# Altium schematic sheet Sheet_1 copy.schdoc
size 309 x 204 mm
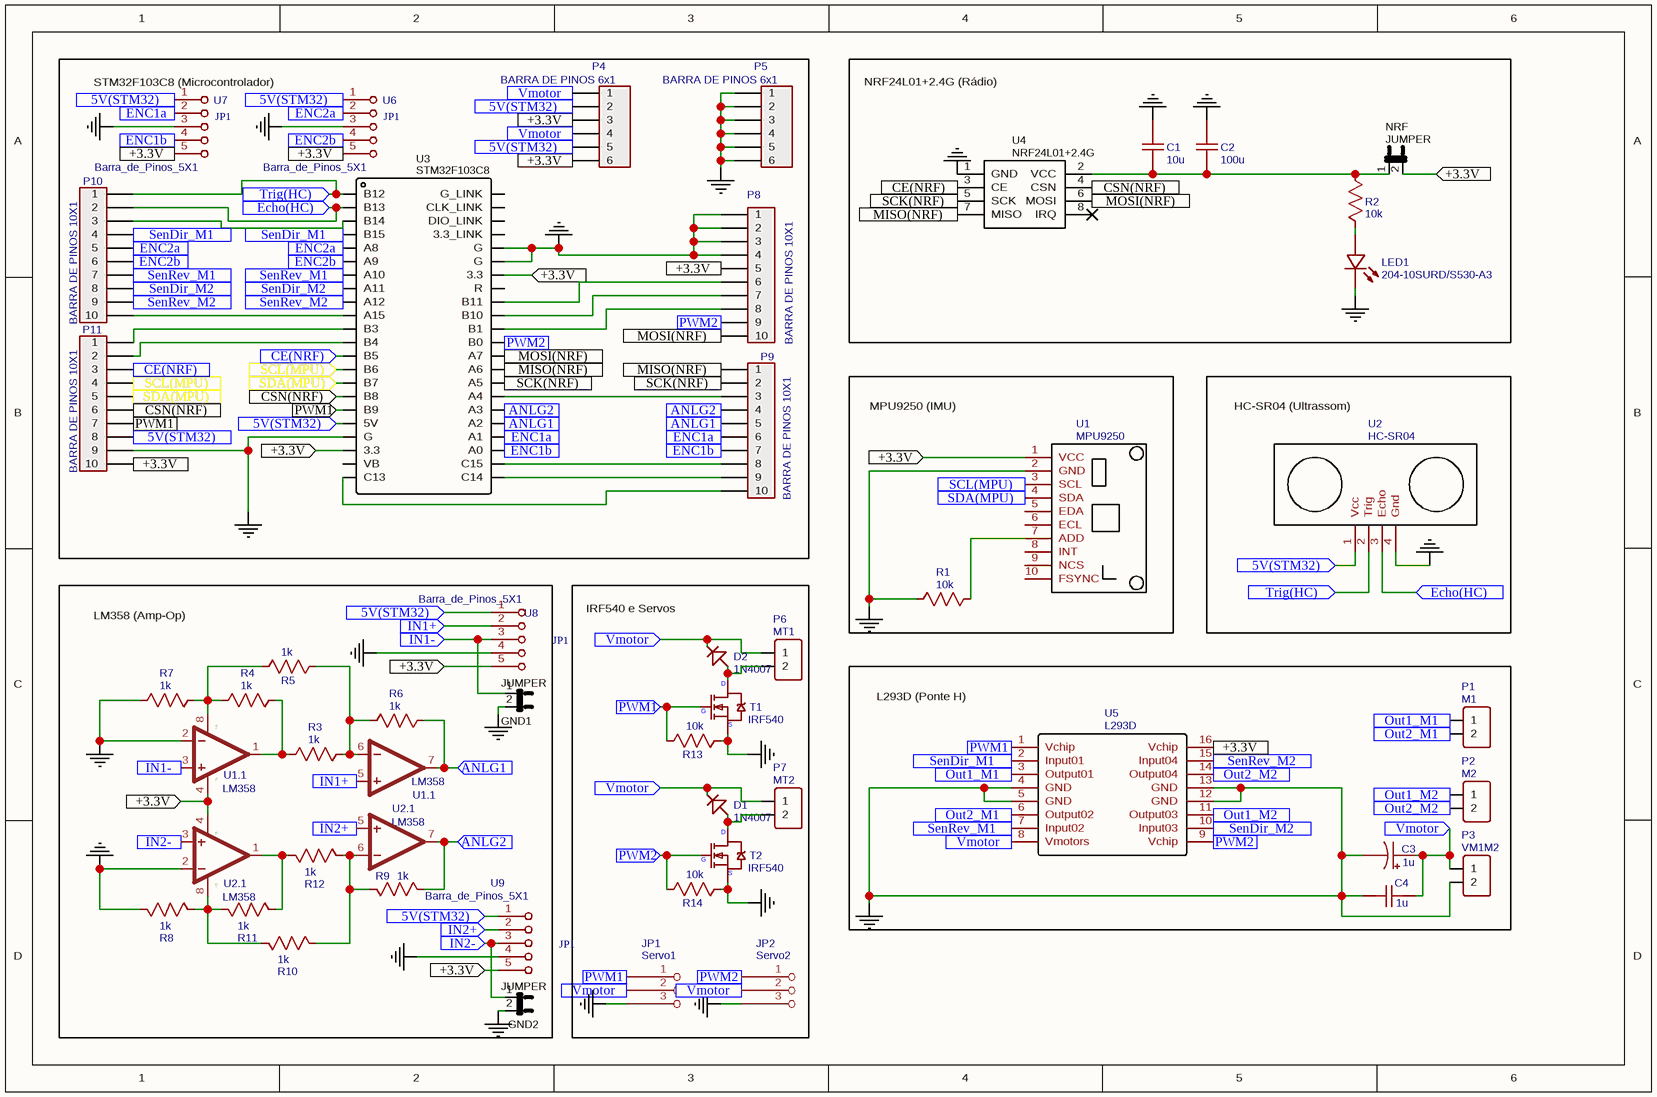
[diagram p0: Sheet_1 copy.schdoc]

## Parts
(Parts that share a designator on the sheet are numbered #1, #2 ... from top to bottom, then left to right.)
C1  10u  [RAD-0.1]
C2  100u  [RAD-0.1]
C3  1u  [CAP-D3.0XF1.5]
C4  1u  [RAD-0.1]
D1  1N4007  [DO-41]
D2  1N4007  [DO-41]
GND1  JUMPER  [1X02]
GND2  JUMPER  [1X02]
JP1  Servo1  [BARRA DE PINOS 1X3]
JP2  Servo2  [BARRA DE PINOS 1X3]
LED1  204-10SURD/S530-A3  [LED-3MM/2.54]
NRF  JUMPER  [1X02]
P1  M1  [HDR-TH_2P-P2.54-V-M]
P2  M2  [HDR-TH_2P-P2.54-V-M]
P3  VM1M2  [HDR-TH_2P-P2.54-V-M]
P4  BARRA DE PINOS 6x1  [BARRA_PINOS7X2]
P5  BARRA DE PINOS 6x1  [BARRA_PINOS7X2]
P6  MT1  [HDR-TH_2P-P2.54-V-M]
P7  MT2  [HDR-TH_2P-P2.54-V-M]
P8  BARRA DE PINOS 10X1  [BARRA DE PINOS 10X1]
P9  BARRA DE PINOS 10X1  [BARRA DE PINOS 10X1]
P10  BARRA DE PINOS 10X1  [BARRA DE PINOS 10X1]
P11  BARRA DE PINOS 10X1  [BARRA DE PINOS 10X1]
R1  10k  [AXIAL-0.3]
R2  10k  [AXIAL-0.3]
R3  1k  [AXIAL-0.3]
R4  1k  [AXIAL-0.3]
R5  1k  [AXIAL-0.3]
R6  1k  [AXIAL-0.3]
R7  1k  [AXIAL-0.3]
R8  1k  [AXIAL-0.3]
R9  1k  [AXIAL-0.3]
R10  1k  [AXIAL-0.3]
R11  1k  [AXIAL-0.3]
R12  1k  [AXIAL-0.3]
R13  10k  [AXIAL-0.3]
R14  10k  [AXIAL-0.3]
T1  IRF540  [IRF540D]
T2  IRF540  [IRF540D]
U1  MPU9250  [MPU9250]
U1.1#1  LM358  [DIP08-KIT]
U1.1#2  LM358  [DIP08-KIT]
U2  HC-SR04  [HC-SR04]
U2.1#1  LM358  [DIP08-KIT]
U2.1#2  LM358  [DIP08-KIT]
U3  STM32F103C8  [STM32F103C8]
U4  NRF24L01+2.4G  [NRF24L01]
U5  L293D  [DIP-16]
U6  Barra_de_Pinos_5X1  [BARRA DE PINOS 5X1]
U7  Barra_de_Pinos_5X1  [BARRA DE PINOS 5X1]
U8  Barra_de_Pinos_5X1  [BARRA DE PINOS 5X1]
U9  Barra_de_Pinos_5X1  [BARRA DE PINOS 5X1]

## Blocks framed on the sheet
STM32F103C8 (Microcontrolador): P4 P5 P8-P11 U3 U6 U7
NRF24L01+2.4G (Rádio): C1 C2 LED1 NRF R2 U4
MPU9250 (IMU): R1 U1
HC-SR04 (Ultrassom): U2
LM358 (Amp-Op): GND1 GND2 R3-R12 U1.1#1 U1.1#2 U2.1#1 U2.1#2 U8 U9
IRF540 e Servos: D1 D2 JP1 JP2 P6 P7 R13 R14 T1 T2
L293D (Ponte H): C3 C4 P1-P3 U5

## Ports
5V(STM32) (in), +3.3V (in), ANLG1 (in), ANLG2 (in), CE(NRF) (in), CSN(NRF) (in), Echo(HC) (in), ENC1a (in), ENC1b (in), ENC2a (in), ENC2b (in), IN1+ (in), IN1- (in), IN2+ (in), IN2- (in), MISO(NRF) (in), MOSI(NRF) (in), Out1_M1 (in), Out1_M2 (in), Out2_M1 (in), Out2_M2 (in), PWM1 (in), PWM2 (in), SCK(NRF) (in), SCL(MPU) (in), SDA(MPU) (in), SenDir_M1 (in), SenDir_M2 (in), SenRev_M1 (in), SenRev_M2 (in), Trig(HC) (in), Vmotor (in)

## Nets
GND: C1.2 C2.2 C3.2 C4.2 GND1.2 GND2.2 JP1.3 JP2.3 LED1.2(K) P3.2 P5.1 P5.2 P5.3 P5.4 P5.5 P5.6 P8.1 P8.2 P8.3 P8.4 P11.9 R1.1 R7.1 R8.1 R13.2 R14.2 T1.3(S) T2.3(S) U1.2(GND) U1.1#1.2(-IN) U2.4(Gnd) U2.1#2.2(-IN) U3.19(G) U3.21(G) U3.22(G) U4.1(GND) U5.4(GND) U5.5(GND) U5.12(GND) U5.13(GND) U6.3 U7.3 U8.4 U9.4
5V(STM32): P4.2 P4.5 P11.8 U2.1(Vcc) U3.18(5V) U6.1 U7.1 U8.1 U9.1 ; port 5V(STM32)
+3.3V: NRF.2 P4.3 P4.6 P8.5 P11.10 U1.1(VCC) U1.1#1.4(V-) U2.1#2.4(V-) U3.20(3.3) U3.23(3.3) U5.16(Vchip) U6.5 U7.5 U8.5 U9.5 ; port +3.3V
ANLG1: P9.5 R6.2 U1.1#2.7(OUT) U3.34(A2) ; port ANLG1
ANLG2: P9.4 R9.2 U2.1#1.7(OUT) U3.33(A3) ; port ANLG2
CE(NRF): P11.3 U3.13(B5) U4.3(CE) ; port CE(NRF)
CSN(NRF): P11.6 U3.16(B8) U4.4(CSN) ; port CSN(NRF)
Echo(HC): P10.2 U2.3(Echo) U3.2(B13) ; port Echo(HC)
ENC1a: P9.6 U3.35(A1) U7.2 ; port ENC1a
ENC1b: P9.7 U3.36(A0) U7.4 ; port ENC1b
ENC2a: P10.5 U3.5(A8) U6.2 ; port ENC2a
ENC2b: P10.6 U3.6(A9) U6.4 ; port ENC2b
IN1+: U1.1#2.5(+IN) U8.2 ; port IN1+
IN1-: GND1.1 U1.1#1.3(+IN) U8.3 ; port IN1-
IN2+: U2.1#1.5(+IN) U9.2 ; port IN2+
IN2-: GND2.1 U2.1#2.3(+IN) U9.3 ; port IN2-
MISO(NRF): P9.1 U3.30(A6) U4.7(MISO) ; port MISO(NRF)
MOSI(NRF): P8.10 U3.29(A7) U4.6(MOSI) ; port MOSI(NRF)
Out1_M1: P1.1 U5.3(Output01) ; port Out1_M1
Out1_M2: P2.1 U5.11(Output03) ; port Out1_M2
Out2_M1: P1.2 U5.6(Output02) ; port Out2_M1
Out2_M2: P2.2 U5.14(Output04) ; port Out2_M2
PWM1: JP1.1 P11.7 R13.1 T1.2(G) U3.17(B9) U5.1(Vchip) ; port PWM1
PWM2: JP2.1 P8.9 R14.1 T2.2(G) U3.28(B0) U5.9(Vchip) ; port PWM2
SCK(NRF): P9.2 U3.31(A5) U4.5(SCK) ; port SCK(NRF)
SCL(MPU): P11.4 U1.3(SCL) U3.14(B6) ; port SCL(MPU)
SDA(MPU): P11.5 U1.4(SDA) U3.15(B7) ; port SDA(MPU)
SenDir_M1: P10.4 U3.4(B15) U5.2(Input01) ; port SenDir_M1
SenDir_M2: P10.8 U3.8(A11) U5.10(Input03) ; port SenDir_M2
SenRev_M1: P10.7 U3.7(A10) U5.7(Input02) ; port SenRev_M1
SenRev_M2: P10.9 U3.9(A12) U5.15(Input04) ; port SenRev_M2
Trig(HC): P10.1 U2.2(Trig) U3.1(B12) ; port Trig(HC)
Vmotor: C3.1 C4.1 D1.2(K) D2.2(K) JP1.2 JP2.2 P3.1 P4.1 P4.4 P6.1 P7.1 U5.8(Vmotors) ; port Vmotor
NetC1_1: C1.1 C2.1 NRF.1 R2.2 U4.2(VCC)
NetD1_1: D1.1(A) P7.2 T2.1(D)
NetD2_1: D2.1(A) P6.2 T1.1(D)
NetLED1_1: LED1.1(A) R2.1
NetP8_6: P8.6 U3.25(B11)
NetP8_7: P8.7 U3.26(B10)
NetP8_8: P8.8 U3.27(B1)
NetP9_3: P9.3 U3.32(A4)
NetP9_8: P9.8 U3.37(C15)
NetP9_9: P9.9 U3.38(C14)
NetP9_10: P9.10 U3.39(C13)
NetP10_3: P10.3 U3.3(B14)
NetP10_10: P10.10 U3.10(A15)
NetP11_1: P11.1 U3.11(B3)
NetP11_2: P11.2 U3.12(B4)
NetR1_2: R1.2 U1.7(ADD)
NetR3_1: R3.1 R4.2 U1.1#1.1(OUT)
NetR3_2: R3.2 R5.2 R6.1 U1.1#2.6(-IN)
NetR4_1: R4.1 R5.1 R7.2 U1.1#1.8(V+)
NetR8_2: R8.2 R10.1 R11.1 U2.1#2.8(V+)
NetR9_1: R9.1 R10.2 R12.2 U2.1#1.6(-IN)
NetR11_2: R11.2 R12.1 U2.1#2.1(OUT)

Not connected (* = marked no-connect by the designer): U1 5(EDA) 6(ECL) 8(INT) 9(NCS) 10(FSYNC); U3 24(R) 40(VB) 41(3.3_LINK) 42(DIO_LINK) 43(CLK_LINK) 44(G_LINK); U4 8(IRQ)*

## Notes on the sheet
- (in symbol Barra_de_Pinos_5X1) JP1

## Library data of the parts
C1 = 10u: nameAlias: Value(F); spicePre: C; spiceSymbolName: Cap_RAD-0.1_US
C2 = 100u: nameAlias: Value(F); spicePre: C; spiceSymbolName: Cap_RAD-0.1_US
C3 C4 = 1u: nameAlias: Value(F); spicePre: C
  C3: spiceSymbolName: Cap_Electrolytic(TH)_D3.0XF1.5_US
  C4: spiceSymbolName: Cap_RAD-0.1_US
D1 D2 = 1N4007: BOM_Manufacturer: DYELEC; BOM_Supplier Part: C84179; BOM_Supplier: LCSC; BOM_Manufacturer Part: 1N4007; spicePre: D; spiceSymbolName: 1N4007
GND1 GND2 NRF = JUMPER: catid: 20; Contributor: SparkFun; BOM_Manufacturer Part: ?; spicePre: J
JP1 = Servo1: Contributor: edutondin; BOM_4 pinos: 3; spicePre: J; spiceSymbolName: BARRA_DE_PINO_1X3
JP2 = Servo2: Contributor: edutondin; BOM_4 pinos: 3; spicePre: J; spiceSymbolName: BARRA_DE_PINO_1X3
LED1 = 204-10SURD/S530-A3: BOM_Manufacturer: EVERLIGHT; BOM_Supplier: LCSC; BOM_Manufacturer Part: 204-10SURD/S530-A3; BOM_Supplier Part: C99772; spicePre: L; spiceSymbolName: 204-10SURD/S530-A3
P1 = M1: BOM_Manufacturer: BOOMELE; BOM_Manufacturer Part: 2.54-1*2PFemale; BOM_Supplier: LCSC; image: //image.lceda.cn/szlcsc/C49661.jpg; BOM_Supplier Part: C49661; spicePre: P; spiceSymbolName: Header-Female-2.54_1x2
P2 = M2: BOM_Manufacturer: BOOMELE; BOM_Manufacturer Part: 2.54-1*2PFemale; BOM_Supplier: LCSC; image: //image.lceda.cn/szlcsc/C49661.jpg; BOM_Supplier Part: C49661; spicePre: P; spiceSymbolName: Header-Female-2.54_1x2
P3 = VM1M2: BOM_Manufacturer: BOOMELE; BOM_Manufacturer Part: 2.54-1*2PFemale; BOM_Supplier: LCSC; image: //image.lceda.cn/szlcsc/C49661.jpg; BOM_Supplier Part: C49661; spicePre: P; spiceSymbolName: Header-Female-2.54_1x2
P4 P5 = BARRA DE PINOS 6x1: Contributor: Projeto Simulador 737-800NG Simulando e Aprendendo!; spicePre: P; spiceSymbolName: BARRA DE PINOS 6x1
P6 = MT1: BOM_Manufacturer: BOOMELE; BOM_Manufacturer Part: 2.54-1*2PFemale; BOM_Supplier: LCSC; image: //image.lceda.cn/szlcsc/C49661.jpg; BOM_Supplier Part: C49661; spicePre: P; spiceSymbolName: Header-Female-2.54_1x2
P7 = MT2: BOM_Manufacturer: BOOMELE; BOM_Manufacturer Part: 2.54-1*2PFemale; BOM_Supplier: LCSC; image: //image.lceda.cn/szlcsc/C49661.jpg; BOM_Supplier Part: C49661; spicePre: P; spiceSymbolName: Header-Female-2.54_1x2
P8-P11 = BARRA DE PINOS 10X1: Contributor: EvairBraga; spicePre: P; spiceSymbolName: BARRA DE PINOS 10X1
R1 R2 R13 R14 = 10k: nameAlias: Value(Ω); spicePre: R; spiceSymbolName: Res_AXIAL-0.3(1/8W)_US
R3-R12 = 1k: nameAlias: Value(Ω); spicePre: R; spiceSymbolName: Res_AXIAL-0.3(1/8W)_US
T1 T2 = IRF540: Contributor: thronborg; BOM_Supplier Part: undefined; spicePre: T; spiceSymbolName: IRF540
U1 = MPU9250: nameAlias: Model; Contributor: BotchPCB; spicePre: X; spiceSymbolName: MPU9250
U1.1#1 U1.1#2 = LM358: subpart_no: 1; Contributor: SparkFun; spicePre: U; spiceSymbolName: LM358
U2 = HC-SR04: Contributor: pedrogramos; BOM_Manufacturer Part: HC-SR04; spicePre: U; spiceSymbolName: HC-SR04
U2.1#1 U2.1#2 = LM358: subpart_no: 2; Contributor: SparkFun; spicePre: U; spiceSymbolName: LM358
U4 = NRF24L01+2.4G: BOM_Manufacturer: Ai-Thinker; BOM_Manufacturer Part: NRF24L01+ 2.4G wireless module; BOM_Supplier: LCSC; spicePre: M; BOM_Supplier Part: C90751
U5 = L293D: BOM_Manufacturer: ST; BOM_EasyEDA: E12340; Contributor: pitreluc; BOM_Supplier Part: E12340; BOM_Supplier: EasyEDA; BOM_Manufacturer Part: L293D; spicePre: U; spiceSymbolName: L293D
U6-U9 = Barra_de_Pinos_5X1: BOM_Manufacturer Part: B; Contributor: DasDokas; spicePre: U; spiceSymbolName: Barra_de_Pinos_5X1
U3 = STM32F103C8: spicePre: X; BOM_Manufacturer Part: ?